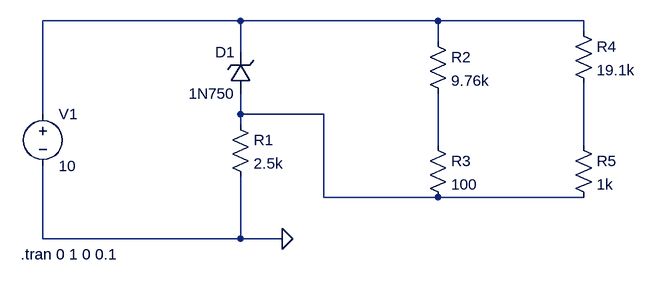
[diagram p0: schematic do pid.asc]
do pid.asc, the LTspice schematic file:
Version 4
SHEET 1 968 680
WIRE 352 -16 48 -16
WIRE 656 -16 352 -16
WIRE 880 -16 656 -16
WIRE 880 0 880 -16
WIRE 656 16 656 -16
WIRE 352 32 352 -16
WIRE 48 128 48 -16
WIRE 352 128 352 96
WIRE 480 128 352 128
WIRE 352 144 352 128
WIRE 656 176 656 96
WIRE 880 176 880 80
WIRE 480 256 480 128
WIRE 656 256 480 256
WIRE 880 256 656 256
WIRE 48 320 48 208
WIRE 352 320 352 224
WIRE 352 320 48 320
WIRE 416 320 352 320
FLAG 416 320 0
SYMBOL voltage 48 112 R0
WINDOW 123 0 0 Left 0
WINDOW 39 0 0 Left 0
SYMATTR InstName V1
SYMATTR Value 10
SYMBOL zener 368 96 R180
WINDOW 0 24 64 Left 2
WINDOW 3 24 0 Left 2
SYMATTR InstName D1
SYMATTR Value 1N750
SYMBOL res 336 128 R0
SYMATTR InstName R1
SYMATTR Value 2.5k
SYMBOL res 640 0 R0
SYMATTR InstName R2
SYMATTR Value 9.76k
SYMBOL res 640 160 R0
SYMATTR InstName R3
SYMATTR Value 100
SYMBOL res 864 -16 R0
SYMATTR InstName R4
SYMATTR Value 19.1k
SYMBOL res 864 160 R0
SYMATTR InstName R5
SYMATTR Value 1k
TEXT 14 344 Left 2 !.tran 0 1 0 0.1

The netlist it stands for:
* do pid.asc
V1 N001 0 10
D1 N002 N001 1N750
R1 N002 0 2.5k
R2 N001 N003 9.76k
R3 N003 N002 100
R4 N001 N004 19.1k
R5 N004 N002 1k
.model D D
.lib standard.dio
.tran 0 1 0 0.1
.backanno
.end